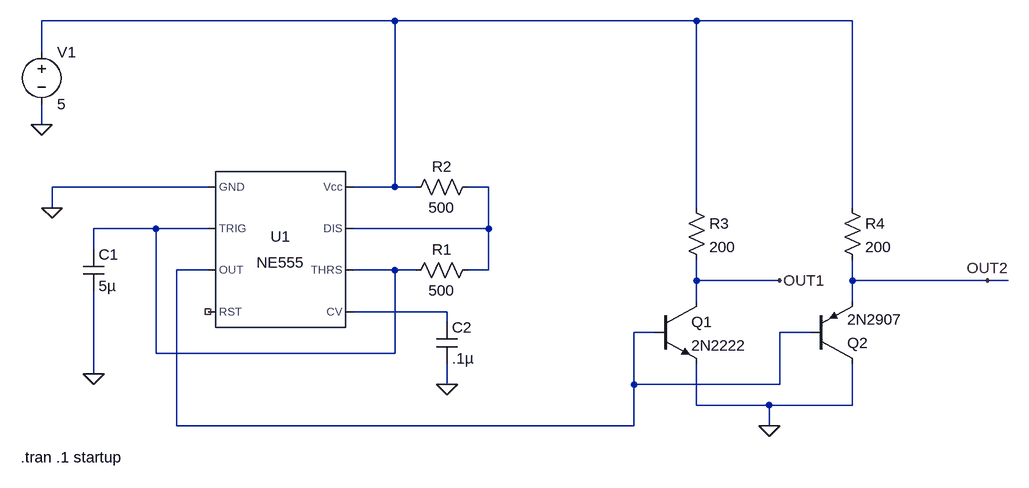
[diagram p0: schematic NE555_Misc.asc]
NE555_Misc.asc, the LTspice schematic file:
Version 4
SHEET 1 1640 680
WIRE 448 -144 -96 -144
WIRE 912 -144 448 -144
WIRE 1152 -144 912 -144
WIRE -96 -96 -96 -144
WIRE -96 16 -96 -16
WIRE 160 112 -80 112
WIRE 448 112 448 -144
WIRE 448 112 384 112
WIRE 480 112 448 112
WIRE 592 112 560 112
WIRE -80 144 -80 112
WIRE 912 144 912 -144
WIRE 1152 144 1152 -144
WIRE 80 176 -16 176
WIRE 160 176 80 176
WIRE 592 176 592 112
WIRE 592 176 384 176
WIRE -16 208 -16 176
WIRE 160 240 112 240
WIRE 448 240 384 240
WIRE 480 240 448 240
WIRE 592 240 592 176
WIRE 592 240 560 240
WIRE 912 256 912 224
WIRE 1040 256 912 256
WIRE 1152 256 1152 224
WIRE 1360 256 1152 256
WIRE 1392 256 1360 256
WIRE 912 288 912 256
WIRE 1152 288 1152 256
WIRE 528 304 384 304
WIRE 528 320 528 304
WIRE 848 336 816 336
WIRE 1088 336 1040 336
WIRE 80 368 80 176
WIRE 448 368 448 240
WIRE 448 368 80 368
WIRE -16 400 -16 272
WIRE 528 416 528 384
WIRE 816 416 816 336
WIRE 1040 416 1040 336
WIRE 1040 416 816 416
WIRE 912 448 912 384
WIRE 1024 448 912 448
WIRE 1152 448 1152 384
WIRE 1152 448 1024 448
WIRE 112 480 112 240
WIRE 816 480 816 416
WIRE 816 480 112 480
WIRE 1024 480 1024 448
FLAG -16 400 0
FLAG -96 16 0
FLAG 528 416 0
FLAG -80 144 0
FLAG 1360 256 OUT2
FLAG 1024 480 0
FLAG 1040 256 OUT1
SYMBOL NE555 272 208 R0
SYMATTR InstName U1
SYMBOL voltage -96 -112 R0
WINDOW 123 0 0 Left 0
WINDOW 39 0 0 Left 0
SYMATTR InstName V1
SYMATTR Value 5
SYMBOL cap -32 208 R0
SYMATTR InstName C1
SYMATTR Value 5µ
SYMBOL res 576 224 R90
WINDOW 0 0 56 VBottom 2
WINDOW 3 32 56 VTop 2
SYMATTR InstName R1
SYMATTR Value 500
SYMBOL res 576 96 R90
WINDOW 0 0 56 VBottom 2
WINDOW 3 32 56 VTop 2
SYMATTR InstName R2
SYMATTR Value 500
SYMBOL cap 512 320 R0
SYMATTR InstName C2
SYMATTR Value .1µ
SYMBOL npn 848 288 R0
SYMATTR InstName Q1
SYMATTR Value 2N2222
SYMBOL pnp 1088 384 M180
SYMATTR InstName Q2
SYMATTR Value 2N2907
SYMBOL res 896 128 R0
SYMATTR InstName R3
SYMATTR Value 200
SYMBOL res 1136 128 R0
SYMATTR InstName R4
SYMATTR Value 200
TEXT -128 528 Left 2 !.tran .1 startup

The netlist it stands for:
* NE555_Misc.asc
XU1 0 N003 N004 NC_01 N005 N003 N002 N001 NE555  ; pins GND TRIG OUT RST CV THRS DIS Vcc
V1 N001 0 5
C1 N003 0 5µ
R1 N002 N003 500
R2 N002 N001 500
C2 N005 0 .1µ
Q1 OUT1 N004 0 0 2N2222
Q2 0 N004 OUT2 0 2N2907
R3 N001 OUT1 200
R4 N001 OUT2 200
.model NPN NPN
.model PNP PNP
.lib standard.bjt
.tran .1 startup
.lib NE555.sub
.backanno
.end

* Results of the author's LTspice run, read from the files saved beside the schematic
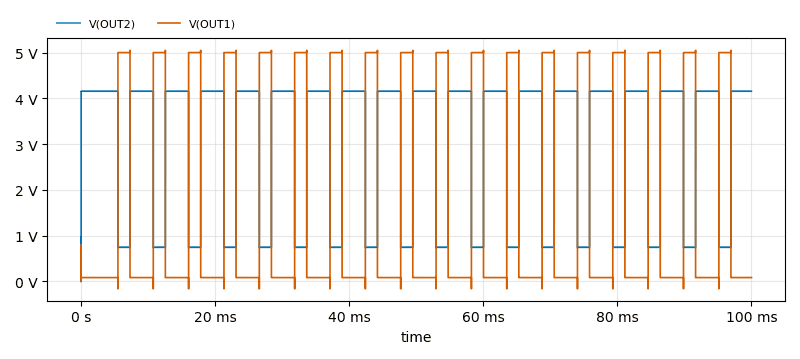
[diagram p1: Transient Analysis of NE555_Misc.asc, plotted from the saved traces]
* Transient Analysis, 1 run:
*   V(OUT2): min 0 V, max 4.156 V, average 3.048 V, rms 3.442 V, last 4.156 V
*   V(OUT1): min -163.6 mV, max 5.049 V, average 1.677 V, rms 2.848 V, last 81.93 mV